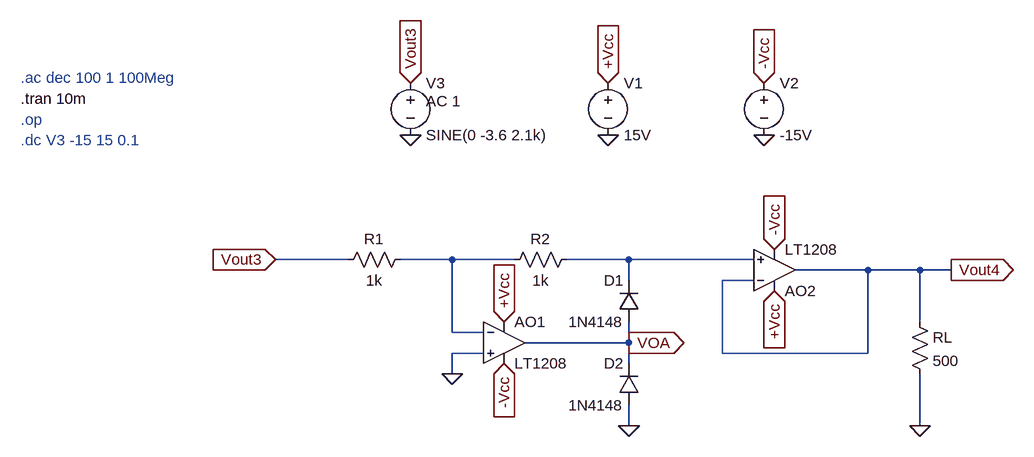
[diagram p0: schematic Redresor.asc]
Redresor.asc, the LTspice schematic file:
Version 4.1
SHEET 1 880 680
WIRE -352 -16 -464 -16
WIRE -192 -16 -272 -16
WIRE -96 -16 -192 -16
WIRE 80 -16 -16 -16
WIRE 272 -16 80 -16
WIRE 448 0 336 0
WIRE 528 0 448 0
WIRE 576 0 528 0
WIRE 80 16 80 -16
WIRE 272 16 224 16
WIRE 528 80 528 0
WIRE -192 96 -192 -16
WIRE -144 96 -192 96
WIRE 80 112 80 80
WIRE 80 112 -80 112
WIRE -144 128 -192 128
WIRE 224 128 224 16
WIRE 448 128 448 0
WIRE 448 128 224 128
WIRE 80 144 80 112
WIRE -192 160 -192 128
WIRE 80 240 80 208
WIRE 528 240 528 160
FLAG -192 160 0
FLAG 80 240 0
FLAG 528 240 0
FLAG -112 80 +Vcc
IOPIN -112 80 In
FLAG 304 32 +Vcc
IOPIN 304 32 In
FLAG -112 144 -Vcc
IOPIN -112 144 In
FLAG 304 -32 -Vcc
IOPIN 304 -32 In
FLAG 576 0 Vout4
IOPIN 576 0 Out
FLAG 80 112 VOA
IOPIN 80 112 Out
FLAG 48 -288 +Vcc
IOPIN 48 -288 In
FLAG 288 -288 -Vcc
IOPIN 288 -288 In
FLAG 48 -208 0
FLAG 288 -208 0
FLAG -256 -208 0
FLAG -256 -288 Vout3
IOPIN -256 -288 In
FLAG -464 -16 Vout3
IOPIN -464 -16 In
SYMBOL res -368 0 R270
WINDOW 0 32 56 VTop 2
WINDOW 3 0 56 VBottom 2
SYMATTR InstName R1
SYMATTR Value 1k
SYMBOL OpAmps\\LT1208 -112 48 R0
SYMATTR InstName AO1
SYMBOL OpAmps\\LT1208 304 64 M180
SYMATTR InstName AO2
SYMBOL res -112 0 R270
WINDOW 0 32 56 VTop 2
WINDOW 3 0 56 VBottom 2
SYMATTR InstName R2
SYMATTR Value 1k
SYMBOL res 512 64 R0
SYMATTR InstName RL
SYMATTR Value 500
SYMBOL diode 96 80 R180
WINDOW 0 24 64 Left 2
WINDOW 3 24 0 Left 2
SYMATTR InstName D1
SYMATTR Value 1N4148
SYMBOL diode 96 208 R180
WINDOW 0 24 64 Left 2
WINDOW 3 24 0 Left 2
SYMATTR InstName D2
SYMATTR Value 1N4148
SYMBOL voltage 48 -304 R0
WINDOW 123 24 44 Left 2
WINDOW 39 0 0 Left 0
SYMATTR InstName V1
SYMATTR Value 15V
SYMBOL voltage 288 -304 R0
SYMATTR InstName V2
SYMATTR Value -15V
SYMBOL voltage -256 -304 R0
WINDOW 123 24 44 Left 2
WINDOW 39 0 0 Left 0
SYMATTR Value2 AC 1
SYMATTR InstName V3
SYMATTR Value SINE(0 -3.6 2.1k)
TEXT -856 -296 Left 2 ;.ac dec 100 1 100Meg
TEXT -856 -264 Left 2 !.tran 10m
TEXT -856 -232 Left 2 ;.op
TEXT -856 -200 Left 2 ;.dc V3 -15 15 0.1

The netlist it stands for:
* Redresor.asc
R1 Vout3 N001 1k
X§AO1 0 N001 +Vcc -Vcc VOA LT1208  ; pins In+ In- V+ V- OUT
X§AO2 N002 Vout4 +Vcc -Vcc Vout4 LT1208  ; pins In+ In- V+ V- OUT
R2 N001 N002 1k
RL Vout4 0 500
D1 VOA N002 1N4148
D2 0 VOA 1N4148
V1 +Vcc 0 15V
V2 -Vcc 0 -15V
V3 Vout3 0 SINE(0 -3.6 2.1k) AC 1
.model D D
.lib standard.dio
* .ac dec 100 1 100Meg
.tran 10m
* .op
* .dc V3 -15 15 0.1
.backanno
.end